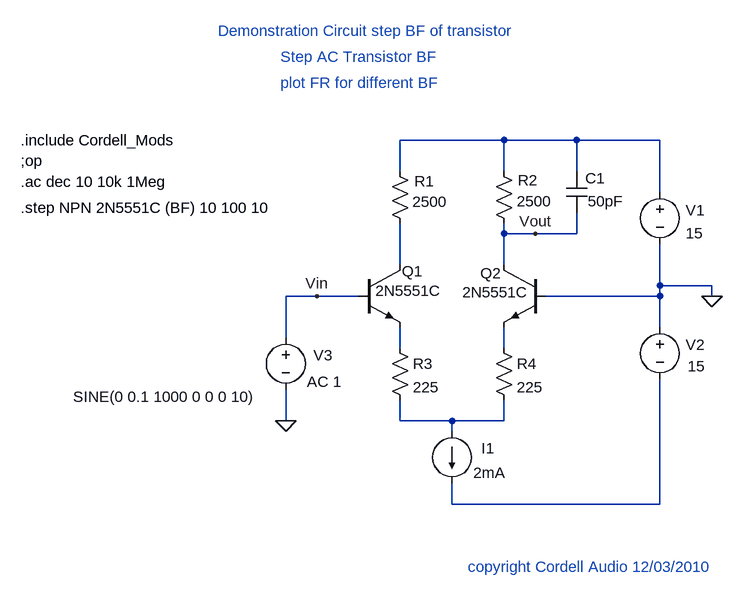
[diagram p0: schematic Demonstration circuit Step ac BF.asc]
Demonstration circuit Step ac BF.asc, the LTspice schematic file:
Version 4
SHEET 1 880 764
WIRE 160 64 0 64
WIRE 272 64 160 64
WIRE 400 64 272 64
WIRE 0 112 0 64
WIRE 160 112 160 64
WIRE 272 112 272 64
WIRE 400 144 400 64
WIRE 160 208 160 192
WIRE 208 208 160 208
WIRE 272 208 272 176
WIRE 272 208 208 208
WIRE 0 256 0 192
WIRE 160 256 160 208
WIRE 400 288 400 224
WIRE 480 288 400 288
WIRE -128 304 -176 304
WIRE -64 304 -128 304
WIRE 400 304 400 288
WIRE 400 304 224 304
WIRE 480 304 480 288
WIRE 400 352 400 304
WIRE -176 368 -176 304
WIRE 0 384 0 352
WIRE 160 384 160 352
WIRE -176 496 -176 448
WIRE 0 496 0 464
WIRE 80 496 0 496
WIRE 160 496 160 464
WIRE 160 496 80 496
WIRE 80 512 80 496
WIRE 80 624 80 592
WIRE 400 624 400 432
WIRE 400 624 80 624
FLAG 480 304 0
FLAG -176 496 0
FLAG -128 304 Vin
FLAG 208 208 Vout
SYMBOL res -16 96 R0
WINDOW 0 38 31 Left 0
WINDOW 3 35 63 Left 0
SYMATTR InstName R1
SYMATTR Value 2500
SYMBOL res 144 96 R0
WINDOW 0 37 30 Left 0
WINDOW 3 36 62 Left 0
SYMATTR InstName R2
SYMATTR Value 2500
SYMBOL voltage 400 128 R0
WINDOW 123 0 0 Left 0
WINDOW 39 0 0 Left 0
WINDOW 0 40 44 Left 0
WINDOW 3 40 79 Left 0
SYMATTR InstName V1
SYMATTR Value 15
SYMBOL voltage 400 336 R0
WINDOW 123 0 0 Left 0
WINDOW 39 0 0 Left 0
WINDOW 0 40 43 Left 0
WINDOW 3 43 76 Left 0
SYMATTR InstName V2
SYMATTR Value 15
SYMBOL npn -64 256 R0
WINDOW 3 26 40 Left 0
WINDOW 0 67 10 Left 0
SYMATTR Value 2N5551C
SYMATTR InstName Q1
SYMBOL npn 224 256 M0
WINDOW 3 26 42 Left 0
WINDOW 0 68 13 Left 0
SYMATTR Value 2N5551C
SYMATTR InstName Q2
SYMBOL res -16 368 R0
SYMATTR InstName R3
SYMATTR Value 225
SYMBOL res 144 368 R0
SYMATTR InstName R4
SYMATTR Value 225
SYMBOL current 80 512 R0
WINDOW 123 0 0 Left 0
WINDOW 39 0 0 Left 0
WINDOW 0 45 26 Left 0
WINDOW 3 33 64 Left 0
SYMATTR InstName I1
SYMATTR Value 2mA
SYMBOL voltage -176 352 R0
WINDOW 3 -327 107 Left 0
WINDOW 123 33 84 Left 0
WINDOW 39 0 0 Left 0
WINDOW 0 43 43 Left 0
SYMATTR Value SINE(0 0.1 1000 0 0 0 10)
SYMATTR Value2 AC 1
SYMATTR InstName V3
SYMBOL cap 256 112 R0
WINDOW 3 33 46 Left 0
WINDOW 0 29 11 Left 0
SYMATTR Value 50pF
SYMATTR InstName C1
TEXT -584 96 Left 0 !;op
TEXT -584 128 Left 0 !.ac dec 10 10k 1Meg
TEXT -280 -104 Left 0 ;Demonstration Circuit step BF of transistor
TEXT -584 168 Left 0 !.step NPN 2N5551C (BF) 10 100 10
TEXT -184 -64 Left 0 ;Step AC Transistor BF
TEXT -184 -24 Left 0 ;plot FR for different BF
TEXT -584 64 Left 0 !.include Cordell_Mods
TEXT 104 720 Left 0 ;copyright Cordell Audio 12/03/2010

The netlist it stands for:
* Demonstration circuit Step ac BF.asc
R1 N001 N002 2500
R2 N001 Vout 2500
V1 N001 0 15
V2 0 N006 15
Q1 N002 Vin N003 0 2N5551C
Q2 Vout 0 N004 0 2N5551C
R3 N003 N005 225
R4 N004 N005 225
I1 N005 N006 2mA
V3 Vin 0 SINE(0 0.1 1000 0 0 0 10) AC 1
C1 N001 Vout 50pF
.model NPN NPN
.model PNP PNP
.lib standard.bjt
;op
.ac dec 10 10k 1Meg
* Demonstration Circuit step BF of transistor
.step NPN 2N5551C (BF) 10 100 10
* Step AC Transistor BF
* plot FR for different BF
.include Cordell_Mods
* copyright Cordell Audio 12/03/2010
.backanno
.end